# Altium schematic sheet Cover.SchDoc
size A3; SheetNumber: 1; SheetTotal: 3
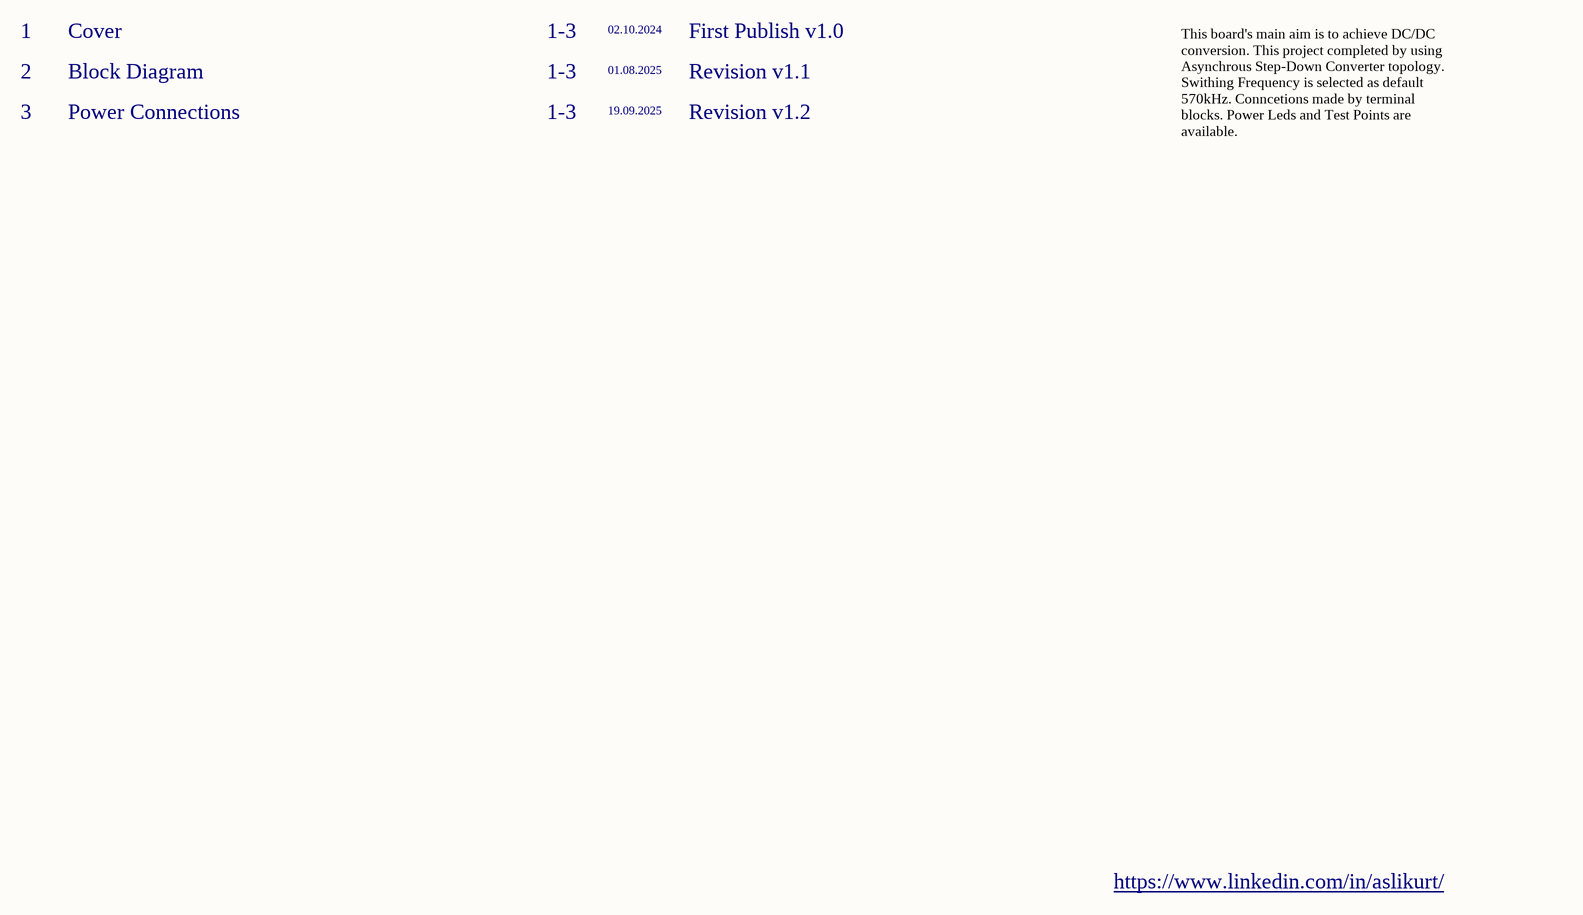
[diagram p0: Cover.SchDoc]

## Notes on the sheet
- 1
- 2
- Cover
- Block Diagram
- 1-3
- 02.10.2024
- 01.08.2025
- First Publish v1.0
- Revision v1.1
- 3
- Power Connections
- 19.09.2025
- Revision v1.2
- This board's main aim is to achieve DC/DC conversion. This project completed by using Asynchrous Step-Down Converter topology. Swithing Frequency is selected as default 570kHz. Conncetions made by terminal blocks. Power Leds and Test Points are available.
- https://www.linkedin.com/in/aslikurt/
- İÇİNDEKİLER / CONTENTS
- REVİZYON / REVISION
- ÜRETİM NOTLARI / PRODUCTION NOTES
- Sayfa Nu.
- Page No
- Açıklama / Description
- Tarih
- Date
- Board Features
- Kart Özellikleri
- Üretim Çıktıları
- Gerber Files
- Ekler
- Attachments
- İLETİŞİM / CONTACT
- DOSYA ADI / FILE NAME
- TANIM / DESCRIPTION
- HAZIRLAYAN / PREPARED BY
- YAYIN TARİHİ / REL. DATE
- BOYUT / SIZE
- SAYFA / SHEET
- /